# EAGLE schematic example (EAGLE 7.6.0)
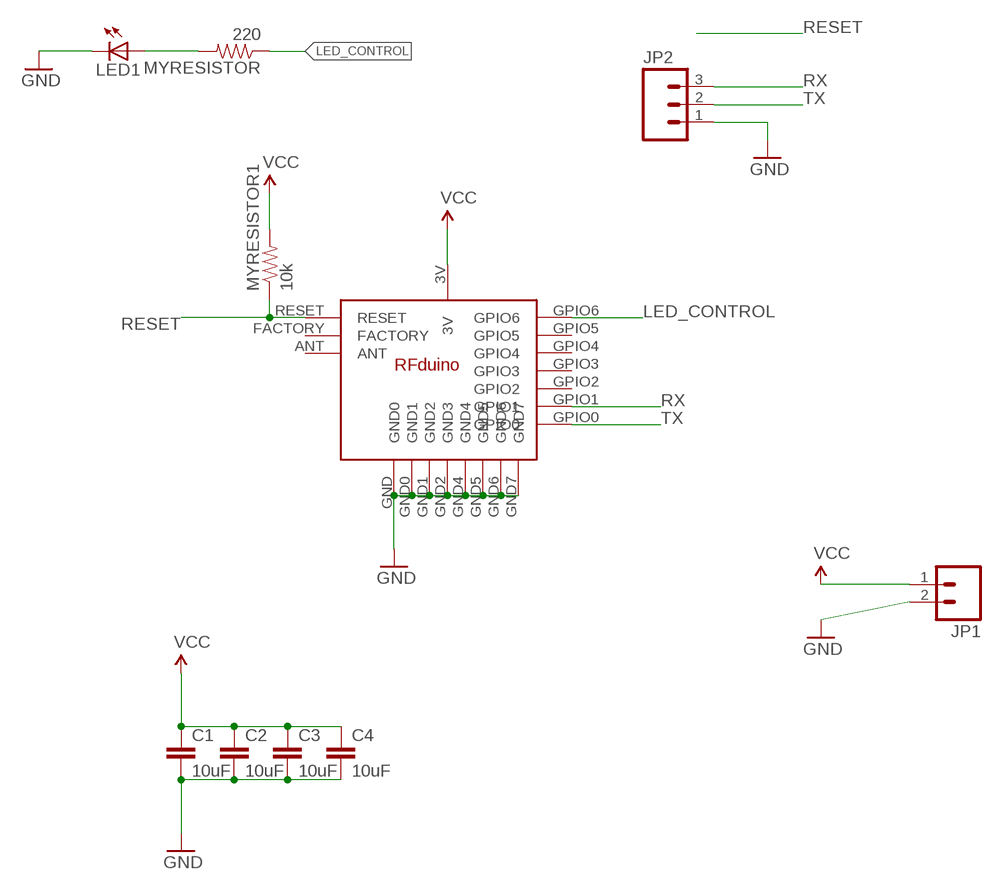
[diagram p0: schematic, sheet 1]

## Parts
C1  10uF  CAP0603-CAP  [0603-CAP]
C2  10uF  CAP0603-CAP  [0603-CAP]
C3  10uF  CAP0603-CAP  [0603-CAP]
C4  10uF  CAP0603-CAP  [0603-CAP]
JP1  M02  [1X02_LONGPADS]
JP2  M03PTH  [1X03]
LED1  LEDCHIP-LED0603  [CHIP-LED0603]
MYRESISTOR  220  RESISTOR0603-RES  [0603-RES]
MYRESISTOR1  10k  RESISTOR0603-RES  [0603-RES]
U$2  RFDUINO  [RFDUINO]

## Nets
GND: C1.2 C2.2 C3.2 C4.2 JP1.2 JP2.1 LED1.C U$2.GND0(GND1) U$2.GND1(GND2) U$2.GND2(GND3) U$2.GND4 U$2.GND5 U$2.GND6 U$2.GND7 U$2.GND(GND0)
LED_CONTROL: MYRESISTOR.1 U$2.GPIO6
N$1: LED1.A MYRESISTOR.2
RESET: MYRESISTOR1.1 U$2.RESET
RX: JP2.3 U$2.GPIO1
TX: JP2.2 U$2.GPIO0
VCC: C1.1 C2.1 C3.1 C4.1 JP1.1 MYRESISTOR1.2 U$2.3V
Unconnected: U$2.ANT U$2.FACTORY U$2.GPIO2 U$2.GPIO3 U$2.GPIO4 U$2.GPIO5

## Library data of the parts
C1-C4 = SparkFun:CAP: Capacitor Standard 0603 ceramic capacitor, and 0.1" leaded capacitor.
JP1 = SparkFun:M02: Header 2 Standard 2-pin 0.1" header. Use with straight break away headers (SKU : PRT-00116), right angle break away headers (PRT-00553), swiss pins (PRT-00743), machine pins (PRT-00117), and female headers (PRT-00115). Molex polarized connector foot print use with SKU : PRT-08233 with associated crimp pins and housings.
JP2 = SparkFun:M03: Header 3 Standard 3-pin 0.1" header. Use with straight break away headers (SKU : PRT-00116), right angle break away headers (PRT-00553), swiss pins (PRT-00743), machine pins (PRT-00117), and female headers (PRT-00115). Molex polarized connector foot print use with SKU : PRT-08232 with associated crimp pins and housings.
LED1 = adafruit:LED: LED OSRAM: - CHIPLED LG R971, LG N971, LY N971, LG Q971, LY Q971, LO R971, LY R971 LH N974, LH R974 LS Q976, LO Q976, LY Q976 LO Q996 - Hyper CHIPLED LW Q18S LB Q993, LB Q99A, LB R99A - SideLED LS A670, LO A670, LY A670, LG A670, LP A670 LB A673, LV A673, LT A673, LW A673 LH A674 LY A675 LS A676, LA A676, LO A676, LY A676, LW A676 LS A679, LY A679, LG A679 - Hyper Micro SIDELED® LS Y876, LA Y876, LO Y876, LY Y876 LT Y87S - SmartLED LW L88C, LW L88S LB L89C, LB L89S, LG L890 LS L89K, LO L89K, LY L89K LS L896, LA L896, LO L896, LY L896 - TOPLED LS T670, LO T670, LY T670, LG T670, LP T670 LSG T670, LSP T670, LSY T670, LOP T670, LYG T670 LG T671, LOG T671, LSG T671 LB T673, LV T673, LT T673, LW T673 LH T674 LS T676, LA T676, LO T676, LY T676, LB T676, LH T676, LSB T676, LW T676 LB T67C, LV T67C, LT T67C, LS T67K, LO T67K, LY T67K, LW E67C LS E67B, LA E67B, LO E67B, LY E67B, LB E67C, LV E67C, LT E67C LW T67C LS T679, LY T679, LG T679 LS T770, LO T770, LY T770, LG T770, LP T770 LB T773, LV T773, LT T773, LW T773 LH T774 LS E675, LA E675, LY E675, LS T675 LS T776, LA T776, LO T776, LY T776, LB T776 LHGB T686 LT T68C, LB T68C - Hyper Mini TOPLED® LB M676 - Mini TOPLED Santana® LG M470 LS M47K, LO M47K, LY M47K Source: http://www.osram.convergy.de/
MYRESISTOR MYRESISTOR1 = SparkFun:RESISTOR: Resistor Basic schematic elements and footprints for 0603, 1206, and PTH 1/10th watt (small) resistors.
U$2 = myLibrary_yay:RFDUINO